# Altium schematic sheet 14_PoE_USB_PD.SchDoc: PoE and USB PD (part 2 of 3)
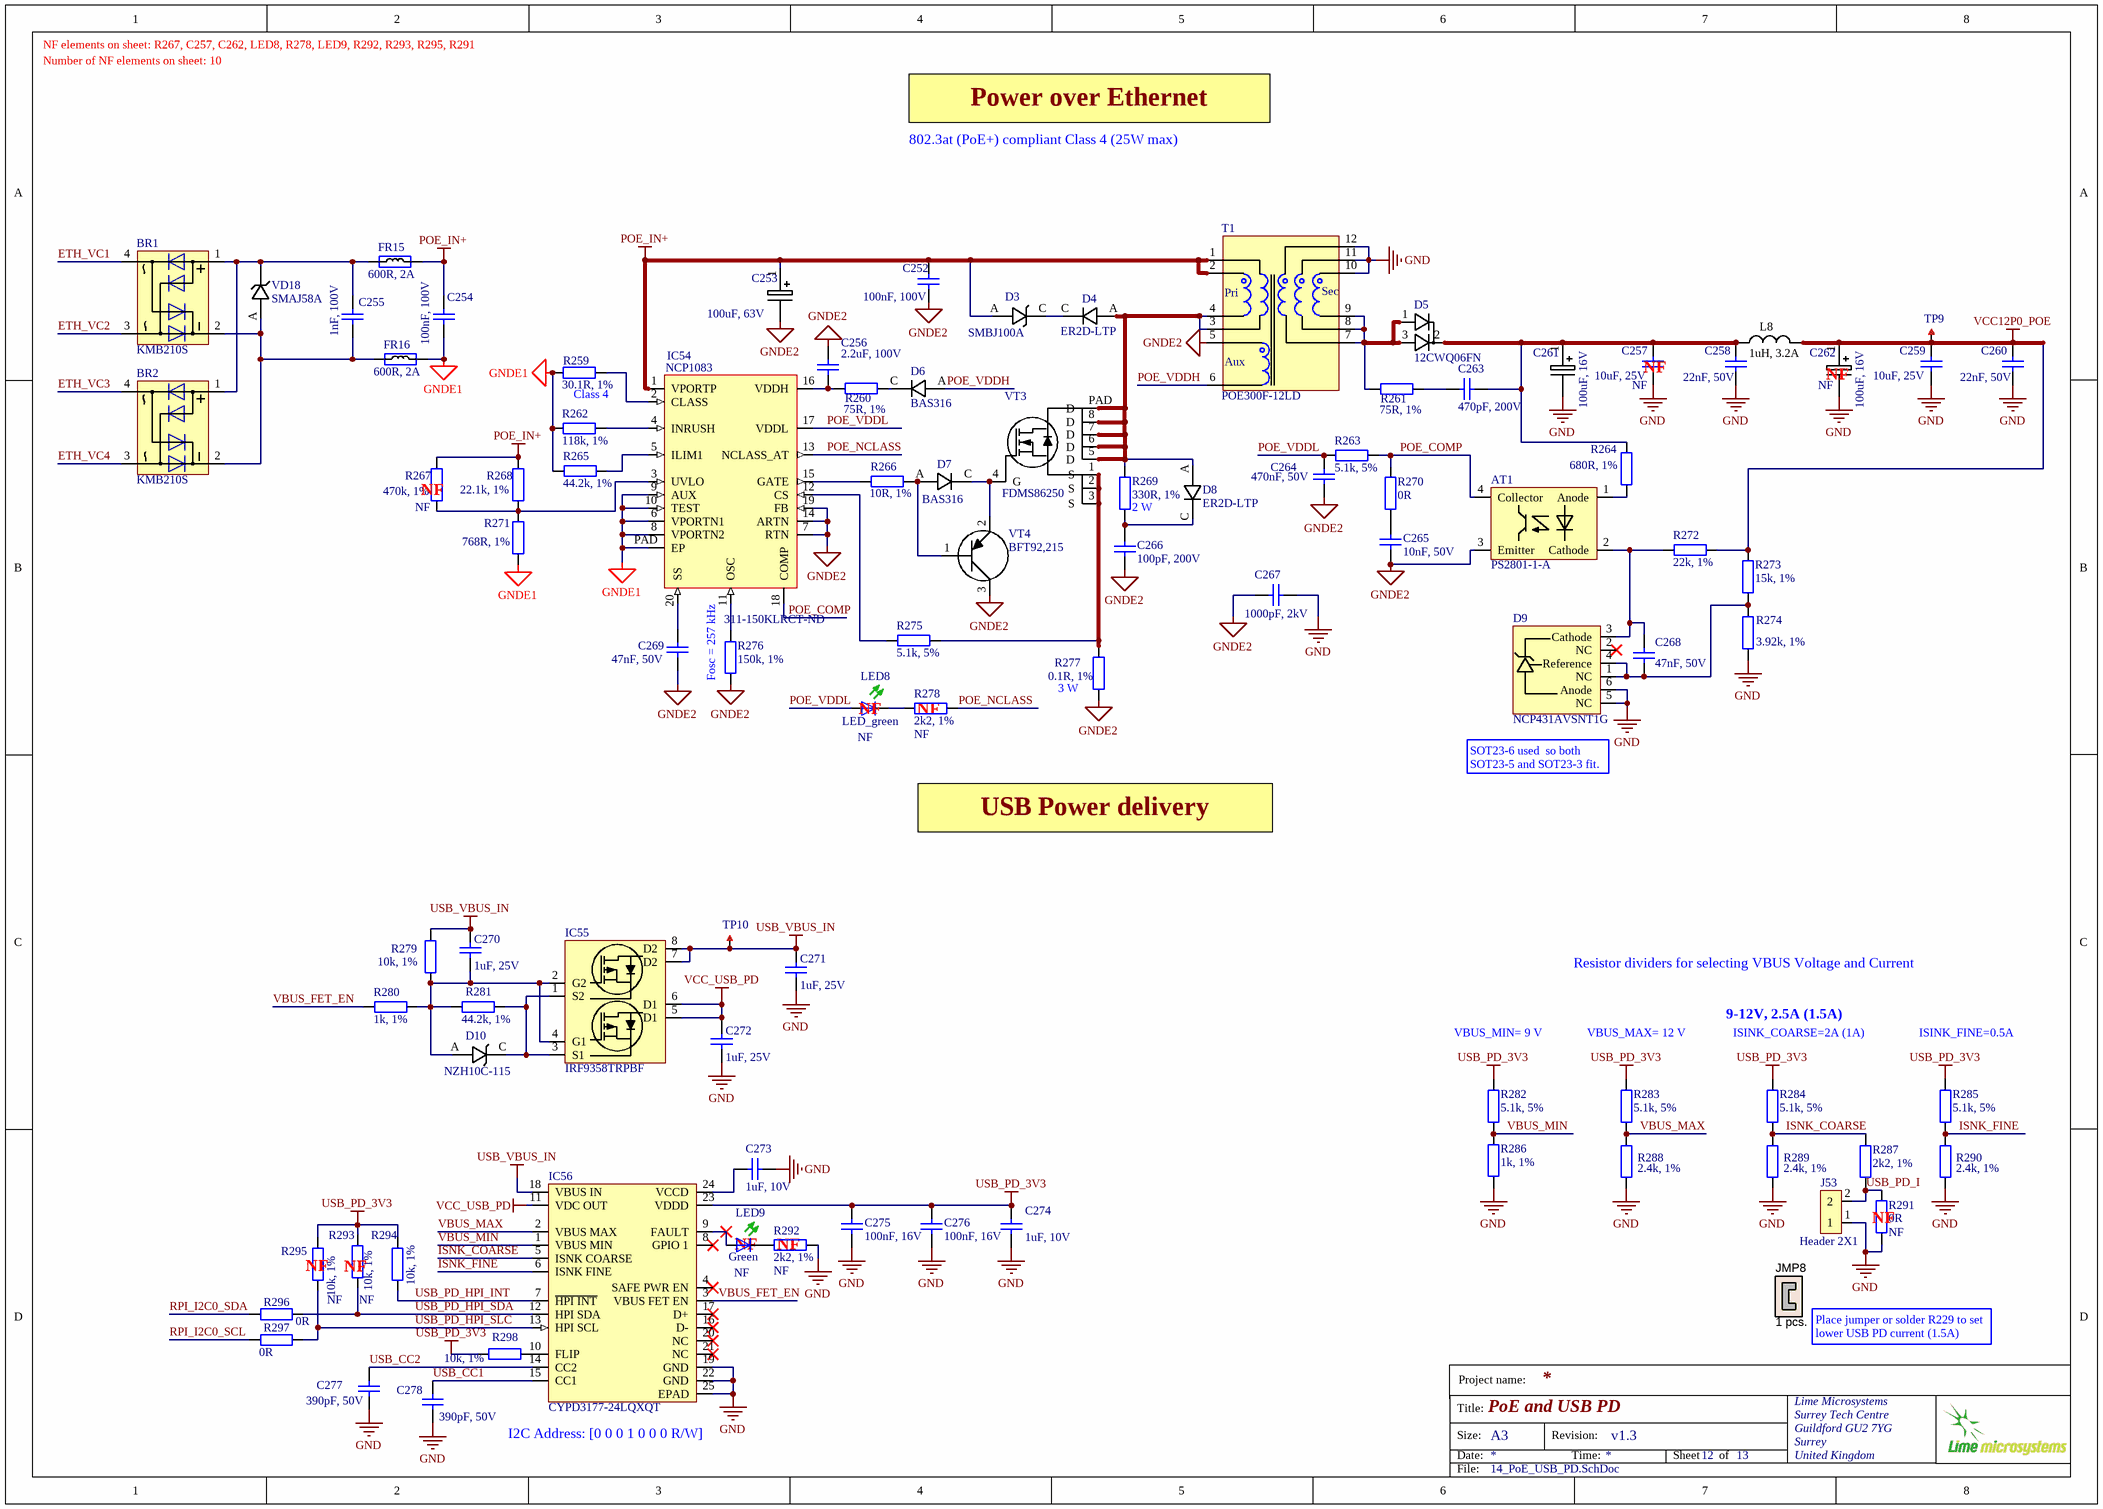
[diagram p1: 14_PoE_USB_PD.SchDoc]
## Library data of the parts
AT1 = TCMT1107CT_optoisolator: Part Description: Transistor Output Optocouplers OPTOCOUPLER 4-PIN SSOP; Manufacturer: Renesas; Isolation Voltage: 2.5kV; Number of Channels: 1; Output Voltage: 80V; Rise Time: 3us; ComponentLink1URL: https://www.verical.com/server-webapp/html/getDatasheet?partID=312696; ComponentLink1Description: https://www.verical.com/server-webapp/html/getDatasheet?partID=312696; ComponentLink2URL: https://www.fairchildsemi.com/datasheets/FO/FOD817A.pdf; ComponentLink2Description: https://www.fairchildsemi.com/datasheets/FO/FOD817A.pdf; ComponentLink3URL: http://www.fairchildsemi.com/ds/FO/FOD817A.pdf; ComponentLink3Description: http://www.fairchildsemi.com/ds/FO/FOD817A.pdf; ComponentLink4URL: http://www.fairchildsemi.com/datasheets/FO/FOD817A.pdf; ComponentLink4Description: http://www.fairchildsemi.com/datasheets/FO/FOD817A.pdf; ComponentLink5URL: http://www.mouser.com/ds/2/149/FOD817A-194238.pdf; ComponentLink5Description: http://www.mouser.com/ds/2/149/FOD817A-194238.pdf; ComponentLink6URL: https://www.fairchildsemi.com/datasheets/FO/FOD817D.pdf; ComponentLink6Description: https://www.fairchildsemi.com/datasheets/FO/FOD817D.pdf; ComponentLink7URL: http://www.jameco.com/Jameco/Products/ProdDS/1107109.pdf; ComponentLink7Description: http://www.jameco.com/Jameco/Products/ProdDS/1107109.pdf; ComponentLink8URL: http://www.vishay.com/docs/83510/tcmt1100.pdf; ComponentLink8Description: http://www.vishay.com/docs/83510/tcmt1100.pdf; ComponentLink9URL: http://www.mouser.com/ds/2/427/tcmt1100-103040.pdf; ComponentLink9Description: http://www.mouser.com/ds/2/427/tcmt1100-103040.pdf; ComponentLink10URL: http://www.farnell.com/datasheets/485045.pdf; ComponentLink10Description: http://www.farnell.com/datasheets/485045.pdf; Parameter 1: *; Supplier 1: Mouser; Supplier Part Number 1: 968-PS2801-1-A; Manufacturer Part Number 1: PS2801-1-A; Stock 1: 2813; Pricing 1: 1=1,17000, 10=0,74200, 50=0,74200, 100=0,54900, 1000=0,44800, 10000=0,43300 (USD); RoHS: Yes; Case/Package: SSOP; Number of Pins: 4; Packaging: Bulk; Package Quantity: 50; Number of Circuits: 1; Lead Free: Lead Free; RoHS Compliant: Yes
BR1 BR2 = KMB210S_RECTIFIER_BRIDGE: Part Description: Bridge Rectifier Single Phase Schottky 100 V Surface Mount MBS; Manufacturer: SMC Diode Solutions; Manufacturer Part Number 1: KMB210S; Supplier Part Number 1: 1655-KMB210SCT-ND; Supplier 1: Digi-Key
C252 C254 = Cap_0603: Manufacturer: Murata Electronics North America; Manufacturer Part Number 1: GRM188R72A104KA35D; Part Description: 0.1µF ±10% 100V Ceramic Capacitor X7R 0603 (1608 Metric); Temperature Coefficient: X7R; Tolerance: ±10%; Notification: Current market demand for these product types have resulted in fluctuating and extending lead times. Lead times may differ.; Value: 100nF, 100V; RoHS: RoHS Compliant; Packaging: Cut Tape (CT); Lead Spacing: -; Voltage - Rated: 100V; Package / Case: 0603 (1608 Metric); Category: Capacitors; Supplier 1: Digi-Key; Applications: General Purpose; Ratings: -; Part Status: Not For New Designs; Operating Temperature: -55°C ~ 125°C; Lead Style: -; Size / Dimension: 0.063" L x 0.031" W (1.60mm x 0.80mm); Supplier Part Number 1: 490-3285-1-ND; Height - Seated (Max): -; Features: -; Thickness (Max): 0.035" (0.90mm); Mounting Type: Surface Mount, MLCC
C253 = Cap_ceramic: Manufacturer: KEMET; Manufacturer Part Number 1: EEV107M063A9PAA; Part Description: 100 µF 63 V Aluminum Electrolytic Capacitors Radial, Can - SMD 2000 Hrs @ 105°C; Life (Hours): 2000Hour; Tolerance: 20%; ComponentLink1URL: http://components.arrow.com/part/dataview/41677645S8110057N1386; ComponentLink1Description: http://components.arrow.com/part/dataview/41677645S8110057N1386; ComponentLink2URL: https://www.distrelec.biz/Web/Downloads/_t/ds/PAN-FK_eng_tds.pdf?mime=application%2Fpdf; ComponentLink2Description: https://www.distrelec.biz/Web/Downloads/_t/ds/PAN-FK_eng_tds.pdf?mime=application%2Fpdf; ComponentLink3URL: http://uk.rs-online.com/webdocs/139e/0900766b8139e40f.pdf; ComponentLink3Description: http://uk.rs-online.com/webdocs/139e/0900766b8139e40f.pdf; ComponentLink4URL: http://www.alliedelec.com/m/d/e9dd47fa10a053d1f2828ce8bc944f54.pdf; ComponentLink4Description: http://www.alliedelec.com/m/d/e9dd47fa10a053d1f2828ce8bc944f54.pdf; ComponentLink5URL: https://industrial.panasonic.com/cdbs/www-data/pdf/RDE0000/ABA0000C1181.pdf; ComponentLink5Description: https://industrial.panasonic.com/cdbs/www-data/pdf/RDE0000/ABA0000C1181.pdf; ComponentLink6URL: http://www.farnell.com/datasheets/2002520.pdf; ComponentLink6Description: http://www.farnell.com/datasheets/2002520.pdf; ComponentLink7URL: http://industrial.panasonic.com/www-data/pdf/ABA0000/ABA0000CE120.pdf; ComponentLink7Description: http://industrial.panasonic.com/www-data/pdf/ABA0000/ABA0000CE120.pdf; ComponentLink8URL: http://www.farnell.com/datasheets/731857.pdf; ComponentLink8Description: http://www.farnell.com/datasheets/731857.pdf; ComponentLink9URL: http://www.produktinfo.conrad.com/datenblaetter/425000-449999/443507-da-01-en-SMD_ELKO_VFK_F_22_UF_100V.pdf; ComponentLink9Description: http://www.produktinfo.conrad.com/datenblaetter/425000-449999/443507-da-01-en-SMD_ELKO_VFK_F_22_UF_100V.pdf; ComponentLink10URL: https://industrial.panasonic.com/cdbs/www-data/pdf/RDE0000/DME0000COL90.pdf; ComponentLink10Description: https://industrial.panasonic.com/cdbs/www-data/pdf/RDE0000/DME0000COL90.pdf; ComponentLink11URL: http://www.industrial.panasonic.com/www-data/pdf/ABA0000/ABA0000CE2.pdf; ComponentLink11Description: http://www.industrial.panasonic.com/www-data/pdf/ABA0000/ABA0000CE2.pdf; ComponentLink12URL: http://www.mouser.com/ds/2/315/ABA0000C1145-947633.pdf; ComponentLink12Description: http://www.mouser.com/ds/2/315/ABA0000C1145-947633.pdf; ComponentLink13URL: http://www.farnell.com/datasheets/2648708.pdf; ComponentLink13Description: http://www.farnell.com/datasheets/2648708.pdf; ComponentLink14URL: http://industrial.panasonic.com/www-data/pdf/ABA0000/ABA0000CE2.pdf; ComponentLink14Description: http://industrial.panasonic.com/www-data/pdf/ABA0000/ABA0000CE2.pdf; ComponentLink15URL: https://datasheet.ciiva.com/15949/41cat-db-al-cgieejppdfnamemve-cgieejppdfnamemve-15949785.pdf?src-supplier=Onlinecomponents.com; ComponentLink15Description: https://datasheet.ciiva.com/15949/41cat-db-al-cgieejppdfnamemve-cgieejppdfnamemve-15949785.pdf?src-supplier=Onlinecomponents.com; Supplier 1: Digi-Key; Supplier Part Number 1: 399-6702-1-ND; Stock 1: 5871; Pricing 1: 1=0,92000, 10=0,69700, 50=0,57940, 100=0,49890 (USD); RoHS: Yes; Mount: Surface Mount; Case/Package: Radial; Min Operating Temperature: -40°C; Max Operating Temperature: 105°C; Termination: SMD/SMT; Package Quantity: 1; Capacitance: 100uF; Voltage Rating: 63V; Packaging: Tape and Reel; Voltage Rating (DC): 63V; Length: 10.2mm; Height - Seated (Max): 0.413inch; ComponentLink16URL: http://www.mouser.com/ds/2/212/KEM_A4002_EEV-535332.pdf?src-supplier=Mouser; ComponentLink16Description: http://www.mouser.com/ds/2/212/KEM_A4002_EEV-535332.pdf?src-supplier=Mouser; ComponentLink17URL: https://content.kemet.com/datasheets/KEM_A4002_EEV.pdf?src-supplier=Digi-Key; ComponentLink17Description: https://content.kemet.com/datasheets/KEM_A4002_EEV.pdf?src-supplier=Digi-Key
C255 = Cap_0603: Manufacturer: KEMET; Manufacturer Part Number 1: C0603C102K1RACTU; Part Description: 1000pF ±10% 100V Ceramic Capacitor X7R 0603 (1608 Metric); Tolerance: 10%; Dielectric: X7R; Dielectric Material: Ceramic; Value: 1nF, 100V; Radiation Hardening: No; Length: 1.6mm; Mount: Surface Mount; Case/Package: 0603; Width: 0.8mm; Height: 0.8mm; Dissipation Factor: 10%; Package Quantity: 1; Lead Pitch: 0.7mm; Voltage: 100V; Voltage Rating: 100V; Case Code (Metric): 1608; Termination: SMD/SMT; Thickness: 0.034inch; REACH SVHC: No SVHC; Supplier Part Number 1: 399-7831-2-ND; Min Operating Temperature: -55°C; Voltage Rating (DC): 100V; Case Code (Imperial): 0603; Number of Pins: 2; Packaging: Tape and Reel; Capacitance: 1nF; Max Operating Temperature: 125°C; Supplier 1: Digi-Key; Depth: 0.8mm
C256 = Cap_1206: Manufacturer: TDK Corporation; Part Description: 2.2µF ±10% 100V Ceramic Capacitor X7S 1206 (3216 Metric); Manufacturer Part Number 1: C3216X7S2A225K160AE; Temperature Coefficient: X7S; Tolerance: ±10%; Size / Dimension: 0.126" L x 0.063" W (3.20mm x 1.60mm); Packaging: Cut Tape (CT); Voltage - Rated: 100V; Category: Capacitors; Operating Temperature: -55°C ~ 125°C; Mounting Type: Surface Mount, MLCC; Lead Spacing: -; Ratings: -; Supplier Part Number 1: 445-8900-1-ND; Lead Style: -; Height - Seated (Max): -; Supplier 1: Digi-Key; Applications: Boardflex Sensitive; Features: Soft Termination; RoHS: RoHS Compliant; Part Status: Active; Thickness (Max): 0.075" (1.90mm); Failure Rate: -; Package / Case: 1206 (3216 Metric); Value: 2.2uF, 100V
C257 C259 = Cap_0603: Part Description: CAP CER 10UF 25V X5R 0805; Manufacturer: Murata; Manufacturer Part Number 1: GRM21BR61E106KA73K; Tolerance: 10%; Dielectric: X5R; value: 10uF, 25V; Supplier 1: Digi-Key; Supplier Part Number 1: 490-16824-1-ND; Stock 1: 781136; Pricing 1: 1=0,19, 10=0,13, 50=0,0778, 100=0,0656, 500=0,0449, 1000=0,03972, 2500=0,038, 5000=0,03454 (USD); RoHS: Yes; Mount: Surface Mount; Case/Package: 0805; Weight: 0.000335oz; Case Code (Imperial): 0805; Case Code (Metric): 2012; Min Operating Temperature: -55°C; Max Operating Temperature: 85°C; Packaging: Tape and Reel; Capacitance: 10uF; Voltage Rating: 25V; Package Quantity: 10000; Voltage Rating (DC): 25V; Series: GRM; Length: 0.079inch; Width: 0.049inch; Thickness: 0.055inch; RoHS Compliant: Yes; ComponentLink1URL: http://www.mouser.com/ds/2/281/c02e-2905.pdf?src-supplier=Mouser; ComponentLink1Description: http://www.mouser.com/ds/2/281/c02e-2905.pdf?src-supplier=Mouser; ComponentLink2URL: http://search.murata.co.jp/Ceramy/image/img/A01X/G101/ENG/GRM21BR61E106KA73-01.pdf?src-supplier=Digi-Key; ComponentLink2Description: http://search.murata.co.jp/Ceramy/image/img/A01X/G101/ENG/GRM21BR61E106KA73-01.pdf?src-supplier=Digi-Key; ComponentLink3URL: https://search.murata.co.jp/Ceramy/image/img/A01X/G101/ENG/GRM21BR61E106KA73-01.pdf?src-supplier=Digi-Key; ComponentLink3Description: https://search.murata.co.jp/Ceramy/image/img/A01X/G101/ENG/GRM21BR61E106KA73-01.pdf?src-supplier=Digi-Key
C258 C260 = Cap_0402: Manufacturer: Kemet; Manufacturer Part Number 1: C0402C223K5RACTU; Part Description: 0.022µF ±10% 50V X7R Ceramic Capacitor -55°C ~ 125°C Surface Mount, MLCC 0402 (1005 Metric) 0.039" L x 0.020" W (1.00mm x 0.50mm); Temperature Coefficient: X7R; Tolerance: ±10%; Capacitance: 0.022µF; Value: 22nF, 50V; Supplier 1: Digi-Key; Supplier Part Number 1: 399-7780-1-ND; Ratings: -; Packaging: Cut Tape (CT); Category: Capacitors; Size / Dimension: 0.039" L x 0.020" W (1.00mm x 0.50mm); RoHS: RoHS Compliant; Operating Temperature: -55°C ~ 125°C; Mounting Type: Surface Mount, MLCC; Applications: General Purpose; Voltage - Rated: 50V; Thickness (Max): 0.022" (0.55mm); Features: -; Height - Seated (Max): -; Lead Style: -; Package / Case: 0402 (1005 Metric); Lead Spacing: -
C261 C262 = Cap_ceramic: Manufacturer: Wurth Electronics; Manufacturer Part Number 1: 875105344010; Part Description: 100 µF 16 V Aluminum - Polymer Capacitors Radial, Can - SMD 20mOhm 2000 Hrs @ 105°C; ESR (Equivalent Series Resistance): 20mR; Polarity: Polar; Ripple Current: 2.69A; Life (Hours): 2000Hour; Tolerance: 20%; Value: 100uF, 16V; ComponentLink1URL: http://components.arrow.com/part/dataview/41677645S8110057N1386; ComponentLink1Description: http://components.arrow.com/part/dataview/41677645S8110057N1386; ComponentLink2URL: https://www.distrelec.biz/Web/Downloads/_t/ds/PAN-FK_eng_tds.pdf?mime=application%2Fpdf; ComponentLink2Description: https://www.distrelec.biz/Web/Downloads/_t/ds/PAN-FK_eng_tds.pdf?mime=application%2Fpdf; ComponentLink3URL: http://uk.rs-online.com/webdocs/139e/0900766b8139e40f.pdf; ComponentLink3Description: http://uk.rs-online.com/webdocs/139e/0900766b8139e40f.pdf; ComponentLink4URL: http://www.alliedelec.com/m/d/e9dd47fa10a053d1f2828ce8bc944f54.pdf; ComponentLink4Description: http://www.alliedelec.com/m/d/e9dd47fa10a053d1f2828ce8bc944f54.pdf; ComponentLink5URL: https://industrial.panasonic.com/cdbs/www-data/pdf/RDE0000/ABA0000C1181.pdf; ComponentLink5Description: https://industrial.panasonic.com/cdbs/www-data/pdf/RDE0000/ABA0000C1181.pdf; ComponentLink6URL: http://www.farnell.com/datasheets/2002520.pdf; ComponentLink6Description: http://www.farnell.com/datasheets/2002520.pdf; ComponentLink7URL: http://industrial.panasonic.com/www-data/pdf/ABA0000/ABA0000CE120.pdf; ComponentLink7Description: http://industrial.panasonic.com/www-data/pdf/ABA0000/ABA0000CE120.pdf; ComponentLink8URL: http://www.farnell.com/datasheets/731857.pdf; ComponentLink8Description: http://www.farnell.com/datasheets/731857.pdf; ComponentLink9URL: http://www.produktinfo.conrad.com/datenblaetter/425000-449999/443507-da-01-en-SMD_ELKO_VFK_F_22_UF_100V.pdf; ComponentLink9Description: http://www.produktinfo.conrad.com/datenblaetter/425000-449999/443507-da-01-en-SMD_ELKO_VFK_F_22_UF_100V.pdf; ComponentLink10URL: https://industrial.panasonic.com/cdbs/www-data/pdf/RDE0000/DME0000COL90.pdf; ComponentLink10Description: https://industrial.panasonic.com/cdbs/www-data/pdf/RDE0000/DME0000COL90.pdf; ComponentLink11URL: http://www.industrial.panasonic.com/www-data/pdf/ABA0000/ABA0000CE2.pdf; ComponentLink11Description: http://www.industrial.panasonic.com/www-data/pdf/ABA0000/ABA0000CE2.pdf; ComponentLink12URL: http://www.mouser.com/ds/2/315/ABA0000C1145-947633.pdf; ComponentLink12Description: http://www.mouser.com/ds/2/315/ABA0000C1145-947633.pdf; ComponentLink13URL: http://www.farnell.com/datasheets/2648708.pdf; ComponentLink13Description: http://www.farnell.com/datasheets/2648708.pdf; ComponentLink14URL: http://industrial.panasonic.com/www-data/pdf/ABA0000/ABA0000CE2.pdf; ComponentLink14Description: http://industrial.panasonic.com/www-data/pdf/ABA0000/ABA0000CE2.pdf; Supplier 1: Digi-Key; Supplier Part Number 1: 732-6425-1-ND; Stock 1: 19075; Pricing 1: 1=0,67000, 50=0,57400, 100=0,50000, 250=0,44500, 500=0,38900 (USD); RoHS: Yes; Mount: Surface Mount; Case/Package: Radial; Min Operating Temperature: -55°C; Max Operating Temperature: 105°C; Package Quantity: 1; Packaging: Cut Tape; Voltage Rating: 16V; Voltage Rating (DC): 16V; Capacitance: 100uF; Series: WCAP-PSLP; Height - Seated (Max): 0.228inch; RoHS Compliant: Yes; ComponentLink15URL: http://www.farnell.com/datasheets/1880501.pdf?src-supplier=Farnell; ComponentLink15Description: http://www.farnell.com/datasheets/1880501.pdf?src-supplier=Farnell; ComponentLink16URL: http://www.farnell.com/datasheets/1880501.pdf?src-supplier=Element14; ComponentLink16Description: http://www.farnell.com/datasheets/1880501.pdf?src-supplier=Element14; ComponentLink17URL: https://katalog.we-online.de/pbs/datasheet/875105344010.pdf?src-supplier=Digi-Key; ComponentLink17Description: https://katalog.we-online.de/pbs/datasheet/875105344010.pdf?src-supplier=Digi-Key; ComponentLink18URL: http://katalog.we-online.de/pbs/datasheet/875105344010.pdf?src-supplier=Digi-Key; ComponentLink18Description: http://katalog.we-online.de/pbs/datasheet/875105344010.pdf?src-supplier=Digi-Key
C263 = Cap_0402: Part Description: Multilayer Ceramic Capacitors MLCC - SMD/SMT 470pF, +-10%, 200V; Manufacturer: Walsin Technologies; Manufacturer Part Number 1: 0603B471K201CT; Supplier 1: Mouser; Supplier Part Number 1: 791-0603B471K201CT; Stock 1: 8000; Pricing 1: 1=0,11000, 10=0,05200, 50=0,05200, 100=0,02400, 1000=0,01300, 10000=0,00900 (USD); RoHS: Yes; RoHS Compliant: Yes
C264 = Cap_0402: Part Description: 0.47 µF ±10% 50V Ceramic Capacitor X5R 0603 (1608 Metric); Manufacturer: Taiyo Yuden; Manufacturer Part Number 1: UMK107ABJ474KA-T; Tolerance: 10%; Dielectric: X5R; ComponentLink1URL: http://www.mouser.com/ds/2/281/c02e-2905.pdf?src-supplier=Mouser; ComponentLink1Description: http://www.mouser.com/ds/2/281/c02e-2905.pdf?src-supplier=Mouser; ComponentLink2URL: http://search.murata.co.jp/Ceramy/image/img/A01X/partnumbering_e_01.pdf?src-supplier=Digi-Key; ComponentLink2Description: http://search.murata.co.jp/Ceramy/image/img/A01X/partnumbering_e_01.pdf?src-supplier=Digi-Key; Value: 470nF, 50V; ComponentLink3URL: http://search.murata.co.jp/Ceramy/image/img/A01X/G101/ENG/GRM155R61H474KE11-01.pdf?src-supplier=Digi-Key; ComponentLink3Description: http://search.murata.co.jp/Ceramy/image/img/A01X/G101/ENG/GRM155R61H474KE11-01.pdf?src-supplier=Digi-Key; ComponentLink4URL: https://search.murata.co.jp/Ceramy/image/img/A01X/G101/ENG/GRM155R61H474KE11-01.pdf?src-supplier=Digi-Key; ComponentLink4Description: https://search.murata.co.jp/Ceramy/image/img/A01X/G101/ENG/GRM155R61H474KE11-01.pdf?src-supplier=Digi-Key; Supplier 1: Digi-Key; Supplier Part Number 1: 587-3171-1-ND; Stock 1: 614194; Pricing 1: 1=0,15000, 10=0,10900, 50=0,06200, 100=0,05140, 500=0,03604, 1000=0,02984 (USD); RoHS: Yes; Mount: Surface Mount; Case/Package: 0603; Case Code (Imperial): 0603; Case Code (Metric): 1608; Min Operating Temperature: -55°C; Max Operating Temperature: 85°C; Capacitance: 470nF; Packaging: Tape and Reel; Package Quantity: 1; Voltage Rating: 50V; Voltage Rating (DC): 50V; Termination: SMD/SMT; Series: M; Construction: Flat; Voltage: 50V; Length: 1.6mm; Width: 0.8mm; Height: 0.8mm; Thickness: 0.037inch; Depth: 0.8mm; Radiation Hardening: No; RoHS Compliant: Yes; Lead Free: Lead Free; ComponentLink5URL: https://datasheet.ciiva.com/30226/445umk107abj474ka-t-30226784.pdf?src-supplier=Onlinecomponents.com; ComponentLink5Description: https://datasheet.ciiva.com/30226/445umk107abj474ka-t-30226784.pdf?src-supplier=Onlinecomponents.com; ComponentLink6URL: https://datasheet.ciiva.com/6282/umk107abj474ka-t-6282326.pdf?src-supplier=Digi-Key; ComponentLink6Description: https://datasheet.ciiva.com/6282/umk107abj474ka-t-6282326.pdf?src-supplier=Digi-Key; ComponentLink7URL: https://datasheet.ciiva.com/15922/30umk107abj474ka-t-15922603.pdf?src-supplier=Onlinecomponents.com; ComponentLink7Description: https://datasheet.ciiva.com/15922/30umk107abj474ka-t-15922603.pdf?src-supplier=Onlinecomponents.com; ComponentLink8URL: https://datasheet.ciiva.com/11600/umk107abj474ka-t-ss-11600413.pdf?src-supplier=Avnet; ComponentLink8Description: https://datasheet.ciiva.com/11600/umk107abj474ka-t-ss-11600413.pdf?src-supplier=Avnet; ComponentLink9URL: https://datasheet.ciiva.com/6282/umk107abj474ka-t-6282332.pdf?src-supplier=Digi-Key; ComponentLink9Description: https://datasheet.ciiva.com/6282/umk107abj474ka-t-6282332.pdf?src-supplier=Digi-Key
C265 = Cap_0402: Part Description: 10000pF ±10% 50V Ceramic Capacitor X7R 0402 (1005 Metric); Manufacturer: Murata Electronics North America; Manufacturer Part Number 1: GRM155R71H103KA88D; Tolerance: ±10%; Temperature Coefficient: X7R; value: 10nF, 50V; Supplier 1: Digi-Key; Supplier Part Number 1: 490-4516-2-ND; Stock 1: 10970000; Pricing 1: 10000=0.00185, 20000=0.00176, 30000=0.00167 (USD); RoHS: RoHS Compliant; Packaging: Tape & Reel (TR); ComponentLink1URL: http://www.murata.com/~/media/webrenewal/support/library/catalog/products/capacitor/mlcc/c02e.ashx?la=en-us; ComponentLink1Description: http://www.murata.com/~/media/webrenewal/support/library/catalog/products/capacitor/mlcc/c02e.ashx?la=en-us; Applications: General Purpose; Category: Capacitors; Features: -; Height - Seated (Max): -; Lead Spacing: -; Lead Style: -; Mounting Type: Surface Mount, MLCC; Operating Temperature: -55°C ~ 125°C; Package / Case: 0402 (1005 Metric); Part Status: Active; Ratings: -; Size / Dimension: 0.039" L x 0.020" W (1.00mm x 0.50mm); Thickness (Max): 0.022" (0.55mm); Voltage - Rated: 50V
C266 = Cap_0402: Part Description: CAP CER 100PF 200V C0G/NPO 0603; Manufacturer: Yageo; Manufacturer Part Number 1: CC0603JRNPOABN101; Dielectric Material: Ceramic; Tolerance: 5%; Dielectric: C0G; Applications: General Purpose; Supplier 1: Digi-Key; Supplier Part Number 1: 311-3979-1-ND; Stock 1: 39006; Pricing 1: 1=0,11000, 10=0,08400, 50=0,04560, 100=0,03720, 500=0,02660, 1000=0,02090 (USD); RoHS: Yes; Mount: Surface Mount; Case/Package: 0603; Case Code (Metric): 1608; Case Code (Imperial): 0603; Weight: 7.1E-05oz; Min Operating Temperature: -55°C; Max Operating Temperature: 125°C; Capacitance: 100pF; Packaging: Tape and Reel; Voltage Rating: 200V; Voltage Rating (DC): 200V; Termination: SMD/SMT; Resistor Type: Ceramic; Series: CC; Construction: Flat; Length: 1.6mm; Width: 0.031inch; Height: 0.8mm; Thickness: 0.035inch; Depth: 0.8mm; Radiation Hardening: No; REACH SVHC: Unknown; RoHS Compliant: Yes; ComponentLink1URL: https://datasheet.ciiva.com/8033/1669968-8033768.pdf?src-supplier=Element14; ComponentLink1Description: https://datasheet.ciiva.com/8033/1669968-8033768.pdf?src-supplier=Element14; ComponentLink2URL: https://datasheet.ciiva.com/8033/1669968-8033767.pdf?src-supplier=Element14; ComponentLink2Description: https://datasheet.ciiva.com/8033/1669968-8033767.pdf?src-supplier=Element14; ComponentLink3URL: https://datasheet.ciiva.com/13263/upy-gp-np0-16v-to-50v-8-3714-13263783.pdf?src-supplier=Mouser; ComponentLink3Description: https://datasheet.ciiva.com/13263/upy-gp-np0-16v-to-50v-8-3714-13263783.pdf?src-supplier=Mouser; ComponentLink4URL: https://datasheet.ciiva.com/11465/upy-np0x7r-mv-100-to-630v-9-11465021.pdf?src-supplier=Avnet; ComponentLink4Description: https://datasheet.ciiva.com/11465/upy-np0x7r-mv-100-to-630v-9-11465021.pdf?src-supplier=Avnet
C267 = Cap_1206: Manufacturer Part Number 1: C1812C102KGRACTU; Manufacturer: KEMET; Part Description: 1000pF ±10% 2000V (2kV) Ceramic Capacitor X7R 1812 (4532 Metric); Manufacturer Part Number: C1812C102KGRACAUTO; Tolerance: ±10%; Notification: Current market demand for these product types have resulted in fluctuating and extending lead times. Lead times may differ.; Voltage - Rated: 2000V (2kV); Temperature Coefficient: X7R; Dielectric Material: Ceramic; Capacitance: 1nF; Packaging: Cut Tape (CT); Supplier Part Number 1: 399-3447-1-ND; Supplier 1: Digi-Key; Part Status: Active; Category: Capacitors; RoHS: RoHS Compliant; Mounting Type: Surface Mount, MLCC; Applications: General Purpose; Lead Style: -; Ratings: -; Height - Seated (Max): -; Thickness (Max): 0.061" (1.55mm); Size / Dimension: 0.177" L x 0.126" W (4.50mm x 3.20mm); Package / Case: 1812 (4532 Metric); Failure Rate: -; Lead Spacing: -; Features: High Voltage; Operating Temperature: -55°C ~ 125°C; Value: 1000pF, 2kV; Supplier 2: Digi-Key; Supplier Part Number 2: 399-16774-1-ND; Stock 2: 4004; Pricing 2: 1=0.51, 10=0.355, 100=0.2132, 500=0.1599 (USD); Case/Package: 1812; Weight: 0.000952oz; Case Code (Imperial): 1812; Case Code (Metric): 4532; Min Operating Temperature: -55°C; Max Operating Temperature: 125°C; Voltage Rating (DC): 2kV; Dielectric: X7R; Termination: SMD/SMT; Length: 4.5mm; Width: 3.2mm
C268 C269 = Cap_0603: Manufacturer: Yageo; Manufacturer Part Number 1: CC0603KRX7R9BB473; Part Description: 0.047µF ±10% 50V Ceramic Capacitor X7R 0603 (1608 Metric); Tolerance: 10%; Dielectric: X7R; Value: 47nF, 50V; Supplier 1: Digi-Key; Supplier Part Number 1: 311-1427-1-ND; Stock 1: 1174358; Pricing 1: 1=0.11, 10=0.08, 100=0.0358, 500=0.02558, 1000=0.0201 (USD); Mount: Surface Mount; Case/Package: 0603; Case Code (Metric): 1608; Case Code (Imperial): 0603; Min Operating Temperature: -55°C; Max Operating Temperature: 125°C; Package Quantity: 1; Capacitance: 47nF; Voltage Rating: 50V; Packaging: Tape and Reel; Voltage Rating (DC): 50V; Termination: SMD/SMT; Composition: Ceramic; Voltage: 50V; Length: 1.6mm; Height: 0.8mm; Width: 0.031inch; Thickness: 0.035inch; Depth: 0.8mm; Radiation Hardening: No; REACH SVHC: Unknown; Lead Free: Lead Free; Halogen Free: Halogen Free; ComponentLink1URL: http://www.yageo.com/documents/recent/UPY-GPHC_X7R_6.3V-to-50V_18.pdf; ComponentLink1Description: http://www.yageo.com/documents/recent/UPY-GPHC_X7R_6.3V-to-50V_18.pdf; ComponentLink2URL: http://www.yageo.com/exep/pages/download/literatures/ProductSelectionGuide%202014_Final_2.pdf; ComponentLink2Description: http://www.yageo.com/exep/pages/download/literatures/ProductSelectionGuide%202014_Final_2.pdf; ComponentLink3URL: http://documents.rs-components.com/techlib://itc_doclist_GB.htm?stockno=6698811; ComponentLink3Description: http://documents.rs-components.com/techlib://itc_doclist_GB.htm?stockno=6698811; ComponentLink4URL: http://www.farnell.com/datasheets/1489800.pdf; ComponentLink4Description: http://www.farnell.com/datasheets/1489800.pdf; ComponentLink5URL: https://www.verical.com/server-webapp/html/getDatasheet?partID=403593; ComponentLink5Description: https://www.verical.com/server-webapp/html/getDatasheet?partID=403593
C270-C272 = Cap_0603: Manufacturer: Samsung Electro-Mechanics; Manufacturer Part Number 1: CL10A105KA8NNNC; Part Description: 1µF ±10% 25V Ceramic Capacitor X5R 0603 (1608 Metric); Notification: Current market demand for these product types have resulted in fluctuating and extending lead times. Lead times may differ.; Temperature Coefficient: X5R; Tolerance: ±10%; Lead Spacing: -; Lead Style: -; Thickness (Max): 0.035" (0.90mm); Features: -; Operating Temperature: -55°C ~ 85°C; Size / Dimension: 0.063" L x 0.031" W (1.60mm x 0.80mm); Height - Seated (Max): -; Applications: General Purpose; Mounting Type: Surface Mount, MLCC; Package / Case: 0603 (1608 Metric); Ratings: -; Supplier Part Number 1: 1276-1102-1-ND; Packaging: Cut Tape (CT); Voltage - Rated: 25V; RoHS: RoHS Compliant; Supplier 1: Digi-Key; Category: Capacitors; Part Status: Active; Value: 1uF, 25V
C273 C274 = Cap_0402: CAP CER 1UF 10V X5R 0402; Manufacturer: Yageo; Part Description: 1µF 10V Ceramic Capacitor X5R 0402 (1005 Metric) 0.039" L x 0.020" W (1.00mm x 0.50mm); Manufacturer Part Number 1: CC0402MRX5R6BB105; Notification: Current market demand for these product types have resulted in fluctuating and extending lead times. Lead times may differ.; Tolerance: ±20%; Value: 1uF, 10V; Supplier 1: Digi-Key; Supplier Part Number 1: 311-1732-1-ND; RoHS: RoHS Compliant; Applications: General Purpose; Category: Capacitors; ComponentLink1Description: http://www.yageo.com/documents/recent/UPY-GPHC_X5R_4V-to-50V_25.pdf; ComponentLink1URL: http://www.yageo.com/documents/recent/UPY-GPHC_X5R_4V-to-50V_25.pdf; Failure Rate: -; Features: -; Height - Seated (Max): -; Lead Spacing: -; Lead Style: -; Mounting Type: Surface Mount, MLCC; Operating Temperature: -55°C ~ 85°C; Package / Case: 0402 (1005 Metric); Packaging: Cut Tape (CT); Part Status: Active; Pricing 1: 1=0.22, 10=0.156, 100=0.0732, 500=0.0513, 1000=0.04248, 2500=0.03953, 5000=0.03617 (USD); Ratings: -; Size / Dimension: 0.039" L x 0.020" W (1.00mm x 0.50mm); Stock 1: 69600; Temperature Coefficient: X5R; Thickness (Max): 0.022" (0.55mm); Voltage - Rated: 10V
C275 C276 = Cap_0603: Manufacturer Part Number 1: GRM155R71C104KA88D; Part Description: 0.10µF ±10% 16V Ceramic Capacitor X7R 0402 (1005 Metric); Brand: Murata Electronics; Tolerance: 10 %; Type: General Purpose MLCC; Capacitance: 0.1 uF; Temperature Coefficient / Code: +/- 15 %; Supplier 1: Mouser; Supplier Part Number 1: 81-GRM155R71C104KA88; Case Code - in: 0402; Manufacturer: Murata Electronics; Category: Multilayer Ceramic Capacitors MLCC - SMD/SMT; Voltage Rating DC: 16 V; Value: 100nF, 16V; Maximum Operating Temperature: + 125 C; Minimum Operating Temperature: - 55 C; Minimum Order Quantity: 1; Operating Temperature Range: - 55 C to + 125 C; Package / Case: 0402 (1005 metric); Packaging: Reel; Product: General Type MLCCs; Product Category: Low & Medium Capacitance SMD Ceramic Chip Capacitors; Reeling: True; RoHS - Mouser: Y; RoHS: RoHS Compliant; Series: GRM; Standard Pack Qty: 10000; Termination Style: SMD/SMT; Manufacturer Part Number: GRM155R71C104KA88D
C277 C278 = Cap_0402: Manufacturer: Samsung; Manufacturer Part Number 1: CL05B391KB5NNNC; Part Description: 390 pF ±10% 50V Ceramic Capacitor X7R 0402 (1005 Metric); Tolerance: 10%; Dielectric: X7R; Value: 390pF, 50V; Supplier 1: Digi-Key; Supplier Part Number 1: 1276-1560-1-ND; Stock 1: 1313447; Pricing 1: 1=0,10000, 10=0,03400, 50=0,01860, 100=0,01520, 500=0,01088, 1000=0,00855, 2500=0,00778, 5000=0,00715 (USD); RoHS: Yes; Mount: Surface Mount; Case/Package: 0402; Case Code (Metric): 1005; Case Code (Imperial): 0402; Min Operating Temperature: -55°C; Max Operating Temperature: 125°C; Packaging: Tape and Reel; Capacitance: 390pF; Package Quantity: 1; Voltage Rating: 50V; Voltage: 50V; Series: CL; Construction: Flat; Length: 1mm; Width: 0.02inch; Height: 0.5mm; Thickness: 0.022inch; Depth: 0.5mm; Radiation Hardening: No; RoHS Compliant: Yes; ComponentLink1URL: https://datasheet.ciiva.com/25738/cl05b391kb5nnnc-25738709.pdf?src-supplier=Digi-Key; ComponentLink1Description: https://datasheet.ciiva.com/25738/cl05b391kb5nnnc-25738709.pdf?src-supplier=Digi-Key; ComponentLink2URL: https://datasheet.ciiva.com/26838/getdatasheetpartid-660062-26838242.pdf?src-supplier=Verical; ComponentLink2Description: https://datasheet.ciiva.com/26838/getdatasheetpartid-660062-26838242.pdf?src-supplier=Verical; ComponentLink3URL: https://datasheet.ciiva.com/16202/cl05b104kq5nnnc-16202591.pdf?src-supplier=Future+Electronics; ComponentLink3Description: https://datasheet.ciiva.com/16202/cl05b104kq5nnnc-16202591.pdf?src-supplier=Future+Electronics
D3 = MMSZ5245B_shottky_diode: Part Description: ESD Suppressors / TVS Diodes 600W 100V 5% Uni-Directional; Manufacturer: Littelfuse; Clamping Voltage: 162V; Peak Pulse Power: 600W; Reverse Standoff Voltage: 100V; Peak Pulse Current: 3.7A; Test Current: 1mA; Min Breakdown Voltage: 111V; Polarity: Unidirectional; Number of Unidirectional Channels: 1; Power Line Protection: No; Leakage Current: 1uA; Diode Type: ZENER; ComponentLink1URL: http://www.mouser.com/ds/2/427/mmsz5225-102133.pdf; ComponentLink1Description: http://www.mouser.com/ds/2/427/mmsz5225-102133.pdf; Supplier 1: Digi-Key; Supplier Part Number 1: SMBJ100ALFCT-ND; Manufacturer Part Number 1: SMBJ100A; Stock 1: 13675; Pricing 1: 1=0,36000, 10=0,29300, 100=0,19970, 500=0,14980, 1000=0,11236 (USD); RoHS: Yes; Mount: Surface Mount; Case/Package: DO-214AA; Number of Pins: 2; Min Operating Temperature: -65°C; Max Operating Temperature: 150°C; Packaging: Tape and Reel; Package Quantity: 3000; Max Surge Current: 3.7A; Breakdown Voltage: 111V; Reverse Breakdown Voltage: 111V; Number of Elements: 1; Operating Supply Voltage: 100V; Number of Channels: 1; Resistor Type: Zener; Series: SMBJ; Termination: SMD/SMT; Voltage Rating (DC): 100V; Length: 5.59mm; Width: 3.94mm; Height: 2.44mm; RoHS Compliant: Yes; Lead Free: Lead Free; ComponentLink2URL: https://datasheet.ciiva.com/331/littelfuse-tvs-diode-smbj-datasheet-pdf-331299.pdf?src-supplier=Digi-Key; ComponentLink2Description: https://datasheet.ciiva.com/331/littelfuse-tvs-diode-smbj-datasheet-pdf-331299.pdf?src-supplier=Digi-Key; ComponentLink3URL: https://datasheet.ciiva.com/331/littelfuse-tvs-diode-smbj-datasheet-pdf-331300.pdf?src-supplier=Digi-Key; ComponentLink3Description: https://datasheet.ciiva.com/331/littelfuse-tvs-diode-smbj-datasheet-pdf-331300.pdf?src-supplier=Digi-Key; ComponentLink4URL: https://datasheet.ciiva.com/331/littelfuse-tvs-diode-smbj-datasheet-pdf-331301.pdf?src-supplier=Digi-Key; ComponentLink4Description: https://datasheet.ciiva.com/331/littelfuse-tvs-diode-smbj-datasheet-pdf-331301.pdf?src-supplier=Digi-Key
D4 D8 = MURA120T3G_diode: Part Description: DIODE GEN PURP 200V 2A DO214AA; Manufacturer: MCC; Average Rectified Current: 2A; Reverse Recovery Time: 35ns; Element Configuration: Single; Max Reverse Voltage (DC): 200V; ComponentLink1URL: http://www.mouser.com/ds/2/427/mmsz5225-102133.pdf; ComponentLink1Description: http://www.mouser.com/ds/2/427/mmsz5225-102133.pdf; ComponentLink2URL: http://www.onsemi.com/pub/Collateral/MMSD4148T1-D.PDF; ComponentLink2Description: http://www.onsemi.com/pub/Collateral/MMSD4148T1-D.PDF; ComponentLink3URL: http://www.farnell.com/datasheets/1707241.pdf; ComponentLink3Description: http://www.farnell.com/datasheets/1707241.pdf; ComponentLink4URL: https://www.verical.com/server-webapp/html/getDatasheet?partID=78734; ComponentLink4Description: https://www.verical.com/server-webapp/html/getDatasheet?partID=78734; ComponentLink5URL: http://www.onsemi.com/pub/Collateral/MURA115T3-D.PDF; ComponentLink5Description: http://www.onsemi.com/pub/Collateral/MURA115T3-D.PDF; ComponentLink6URL: http://www.jameco.com/Jameco/Products/ProdDS/1100812.pdf; ComponentLink6Description: http://www.jameco.com/Jameco/Products/ProdDS/1100812.pdf; ComponentLink7URL: http://uk.rs-online.com/webdocs/1221/0900766b812212fb.pdf; ComponentLink7Description: http://uk.rs-online.com/webdocs/1221/0900766b812212fb.pdf; ComponentLink8URL: http://www.farnell.com/datasheets/1750742.pdf; ComponentLink8Description: http://www.farnell.com/datasheets/1750742.pdf; Supplier 1: Digi-Key; Supplier Part Number 1: 353-ER2D-LTPCT-ND; Manufacturer Part Number 1: ER2D-LTP; Stock 1: 4206; Pricing 1: 1=0,45000, 10=0,33600, 100=0,20900, 500=0,14300, 1000=0,11000 (USD); RoHS: Yes; Mount: Surface Mount; Package Quantity: 3000; Packaging: Tape and Reel; Series: -; Lead Free: Lead Free; RoHS Compliant: Yes; ComponentLink9URL: https://datasheet.ciiva.com/6369/er2a-ler2j-ldo-214aa-6369821.pdf?src-supplier=Digi-Key; ComponentLink9Description: https://datasheet.ciiva.com/6369/er2a-ler2j-ldo-214aa-6369821.pdf?src-supplier=Digi-Key
D5 = 12CWQ06FN_diode_array: Part Description: Diode Array 1 Pair Common Cathode Schottky 60 V Surface Mount TO-252-3, DPak (2 Leads + Tab), SC-63; Manufacturer: Sangdest Microelectronics; Supplier 1: Digi-Key; Supplier Part Number 1: 1655-12CWQ06FNCT-ND; Manufacturer Part Number 1: 12CWQ06FN; Stock 1: 56408; Pricing 1: 1=0,70000, 10=0,61700, 100=0,47270, 500=0,37364, 1000=0,29892 (USD); RoHS: No
D6 D7 = MURA120T3G_diode: Part Description: DIODE GEN PURP 100V 250MA SOD323; Manufacturer: Nexperia; Manufacturer Part Number 1: BAS316,115; ComponentLink1URL: http://www.mouser.com/ds/2/427/mmsz5225-102133.pdf; ComponentLink1Description: http://www.mouser.com/ds/2/427/mmsz5225-102133.pdf; ComponentLink2URL: http://www.onsemi.com/pub/Collateral/MMSD4148T1-D.PDF; ComponentLink2Description: http://www.onsemi.com/pub/Collateral/MMSD4148T1-D.PDF; ComponentLink3URL: http://www.farnell.com/datasheets/1707241.pdf; ComponentLink3Description: http://www.farnell.com/datasheets/1707241.pdf; ComponentLink4URL: https://www.verical.com/server-webapp/html/getDatasheet?partID=78734; ComponentLink4Description: https://www.verical.com/server-webapp/html/getDatasheet?partID=78734; ComponentLink5URL: http://www.onsemi.com/pub/Collateral/MURA115T3-D.PDF; ComponentLink5Description: http://www.onsemi.com/pub/Collateral/MURA115T3-D.PDF; ComponentLink6URL: http://www.jameco.com/Jameco/Products/ProdDS/1100812.pdf; ComponentLink6Description: http://www.jameco.com/Jameco/Products/ProdDS/1100812.pdf; ComponentLink7URL: http://uk.rs-online.com/webdocs/1221/0900766b812212fb.pdf; ComponentLink7Description: http://uk.rs-online.com/webdocs/1221/0900766b812212fb.pdf; ComponentLink8URL: http://www.farnell.com/datasheets/1750742.pdf; ComponentLink8Description: http://www.farnell.com/datasheets/1750742.pdf; Supplier 1: Digi-Key; Supplier Part Number 1: 1727-4309-1-ND; Stock 1: 163548; Pricing 1: 1=0,16000, 10=0,14200, 100=0,07710, 500=0,04744, 1000=0,03234 (USD); RoHS: Yes; RoHS Compliant: Yes; ComponentLink9URL: http://www.farnell.com/datasheets/1856332.pdf?src-supplier=Farnell; ComponentLink9Description: http://www.farnell.com/datasheets/1856332.pdf?src-supplier=Farnell; ComponentLink10URL: https://assets.nexperia.com/documents/data-sheet/BAS16_SER.pdf?src-supplier=Digi-Key; ComponentLink10Description: https://assets.nexperia.com/documents/data-sheet/BAS16_SER.pdf?src-supplier=Digi-Key; ComponentLink11URL: http://www.farnell.com/datasheets/1856332.pdf?src-supplier=Newark; ComponentLink11Description: http://www.farnell.com/datasheets/1856332.pdf?src-supplier=Newark
D9 = NCP431AVSNT1GOSCT_VREF: Part Description: Shunt Voltage Reference IC Adjustable 2.5V 36 VV ±1% 100 mA SOT-23-3 (TO-236); Manufacturer: ON Semiconductor; Max Input Voltage: 2.525V; Max Output Current: 100mA; Output Voltage: 36V; Min Input Voltage: 2.475V; Tolerance: 1%; Min Output Voltage: 2.5V; Temperature Coefficient: 50ppm/°C; Cathode Current: 60uA; Reference Type: Shunt,Adjustable,Programmable; Output Type: Adjustable; Supplier 1: Digi-Key; Supplier Part Number 1: NCP431AVSNT1GOSCT-ND; Manufacturer Part Number 1: NCP431AVSNT1G; Stock 1: 4600; Pricing 1: 1=0,44000, 10=0,35700, 25=0,32640, 100=0,24290, 250=0,22008, 500=0,18216, 1000=0,13661 (USD); RoHS: Yes; Case/Package: SOT-23-3; Number of Pins: 3; Min Operating Temperature: -40°C; Max Operating Temperature: 125°C; Package Quantity: 3000; Packaging: Tape and Reel; Max Output Voltage: 36V; Output Current: 100mA; Reference Voltage: 2.5V; Length: 3.04mm; Width: 1.4mm; Height: 1.01mm; Radiation Hardening: No; REACH SVHC: No SVHC; Lead Free: Lead Free; Halogen Free: Halogen Free; ComponentLink1URL: https://datasheet.ciiva.com/8132/ncp431-d-8132432.pdf?src-supplier=Avnet; ComponentLink1Description: https://datasheet.ciiva.com/8132/ncp431-d-8132432.pdf?src-supplier=Avnet; ComponentLink2URL: https://datasheet.ciiva.com/30476/0900766b8121bbe3-30476322.pdf?src-supplier=RSComponents; ComponentLink2Description: https://datasheet.ciiva.com/30476/0900766b8121bbe3-30476322.pdf?src-supplier=RSComponents; ComponentLink3URL: https://datasheet.ciiva.com/49020/70300496-49020892.pdf?src-supplier=Allied+Electronics; ComponentLink3Description: https://datasheet.ciiva.com/49020/70300496-49020892.pdf?src-supplier=Allied+Electronics
D10 = MMSZ5245B_shottky_diode: Part Description: DIODE ZENER 10V 500MW SOD123F; Manufacturer: Nexperia; Manufacturer Part Number 1: NZH10C,115; ComponentLink1URL: http://www.mouser.com/ds/2/427/mmsz5225-102133.pdf; ComponentLink1Description: http://www.mouser.com/ds/2/427/mmsz5225-102133.pdf; ComponentLink2URL: https://datasheet.ciiva.com/331/littelfuse-tvs-diode-smbj-datasheet-pdf-331299.pdf?src-supplier=Digi-Key; ComponentLink2Description: https://datasheet.ciiva.com/331/littelfuse-tvs-diode-smbj-datasheet-pdf-331299.pdf?src-supplier=Digi-Key; ComponentLink3URL: https://datasheet.ciiva.com/331/littelfuse-tvs-diode-smbj-datasheet-pdf-331300.pdf?src-supplier=Digi-Key; ComponentLink3Description: https://datasheet.ciiva.com/331/littelfuse-tvs-diode-smbj-datasheet-pdf-331300.pdf?src-supplier=Digi-Key; ComponentLink4URL: https://datasheet.ciiva.com/331/littelfuse-tvs-diode-smbj-datasheet-pdf-331301.pdf?src-supplier=Digi-Key; ComponentLink4Description: https://datasheet.ciiva.com/331/littelfuse-tvs-diode-smbj-datasheet-pdf-331301.pdf?src-supplier=Digi-Key; Supplier 1: Digi-Key; Supplier Part Number 1: 1727-5057-1-ND; Stock 1: 6768; Pricing 1: 1=0,27000, 10=0,22200, 100=0,11780, 500=0,07752, 1000=0,05271 (USD); RoHS: Yes; RoHS Compliant: Yes; ComponentLink5URL: http://www.farnell.com/datasheets/1508365.pdf?src-supplier=Farnell; ComponentLink5Description: http://www.farnell.com/datasheets/1508365.pdf?src-supplier=Farnell
FR15 FR16 = Ferrite: Manufacturer Part Number 1: MPZ2012S601AT000; Manufacturer: TDK Corporation; Part Description: FERRITE BEAD 600 OHM 0805 1LN; Filter Type: Differential Mode - Single; Impedance @ Frequency: 600 Ohm @ 100MHz; DC Resistance (DCR): 100 mOhm Max; Supplier 1: Digi-Key; Supplier Part Number 1: 445-2206-2-ND; Mounting Type: Surface Mount; RoHS: RoHS Compliant; Height (Max): 0.041" (1.05mm); Packaging: Tape & Reel (TR); Category: Filters; Current Rating: 2A; Package / Case: 0805 (2012 Metric); Size / Dimension: 0.079" L x 0.049" W (2.00mm x 1.25mm); Value: 600R, 2A
IC54 = NCP1083_PoE_controller: Part Description: Power Over Ethernet Controller 1 Channel 802.3at (PoE+), 802.3af (PoE) 20-TSSOP-EP; Manufacturer: ON Semiconductor; Manufacturer Part Number: NCP1083DER2G; Nominal Supply Current: 1.1A; Frequency: 500kHz; Output Voltage: 9V; Number of Outputs: 1; Max Duty Cycle: 80%; Max Power Dissipation: 40W; Topology: Flyback; Supplier 1: Digi-Key; Supplier Part Number 1: NCP1083DER2GOSCT-ND; Stock 1: 12659; Pricing 1: 1=4,10000, 10=3,68200, 25=3,48120, 100=3,01700, 250=2,86228, 500=2,56832, 1000=2,16605 (USD); RoHS: Yes; Case/Package: TSSOP; Number of Pins: 20; Min Operating Temperature: -40°C; Max Operating Temperature: 85°C; Switching Frequency: 500kHz; Output Current: 1.1A; Package Quantity: 2500; Packaging: Tape and Reel; Number of Channels: 1; Series: -; Supply Current: 1.1A; Radiation Hardening: No; REACH SVHC: No SVHC; Lead Free: Lead Free; Halogen Free: Halogen Free; RoHS Compliant: Yes; ComponentLink1URL: https://datasheet.ciiva.com/9213/ncp1083-d-9213696.pdf?src-supplier=Avnet; ComponentLink1Description: https://datasheet.ciiva.com/9213/ncp1083-d-9213696.pdf?src-supplier=Avnet; ComponentLink2URL: https://datasheet.ciiva.com/1573/1441870-1573173.pdf?src-supplier=Farnell; ComponentLink2Description: https://datasheet.ciiva.com/1573/1441870-1573173.pdf?src-supplier=Farnell; ComponentLink3URL: https://datasheet.ciiva.com/1647/1441870-1647157.pdf?src-supplier=Newark; ComponentLink3Description: https://datasheet.ciiva.com/1647/1441870-1647157.pdf?src-supplier=Newark; ComponentLink4URL: https://datasheet.ciiva.com/1573/1441870-1573174.pdf?src-supplier=Farnell; ComponentLink4Description: https://datasheet.ciiva.com/1573/1441870-1573174.pdf?src-supplier=Farnell; ComponentLink5URL: https://datasheet.ciiva.com/16469/ncp1083-d-16469798.pdf?src-supplier=Future+Electronics; ComponentLink5Description: https://datasheet.ciiva.com/16469/ncp1083-d-16469798.pdf?src-supplier=Future+Electronics; ComponentLink6URL: https://datasheet.ciiva.com/1512/1441870-1512909.pdf?src-supplier=Element14; ComponentLink6Description: https://datasheet.ciiva.com/1512/1441870-1512909.pdf?src-supplier=Element14; Manufacturer Part Number 1: NCP1083DER2G
IC55 = IRF9358TRPBF_DUAL_NMOS: Part Description: Mosfet Array 2 P-Channel (Dual) 30V 9.2A 2W Surface Mount 8-SO; Manufacturer: International Rectifier; Element Configuration: Dual; Drain to Source Breakdown Voltage: -30V; Rise Time: 7.2ns; Rds On Max: 16.3mR; Input Capacitance: 1.74nF; Nominal Vgs: -1.8V; Gate to Source Voltage (Vgs): 20V; Power Dissipation: 2W; Drain to Source Voltage (Vdss): 30V; Continuous Drain Current (ID): 9.2A; Turn-On Delay Time: 5.7ns; Turn-Off Delay Time: 146ns; Fall Time: 69ns; Drain to Source Resistance: 23.8mR; Supplier 1: Digi-Key; Supplier Part Number 1: IRF9358TRPBFDKR-ND; Manufacturer Part Number 1: IRF9358TRPBF; Stock 1: 0; RoHS: Yes; Mount: Surface Mount; Case/Package: SOIC; Number of Pins: 8; Min Operating Temperature: -55°C; Max Operating Temperature: 150°C; Package Quantity: 1; Packaging: Tape and Reel; Max Power Dissipation: 2W; Length: 5mm; Width: 4mm; Height: 1.5mm; Radiation Hardening: No; REACH SVHC: No SVHC; ComponentLink1URL: https://datasheet.ciiva.com/7798/irf9358pbf-7798959.pdf?src-supplier=Element14; ComponentLink1Description: https://datasheet.ciiva.com/7798/irf9358pbf-7798959.pdf?src-supplier=Element14; ComponentLink2URL: https://datasheet.ciiva.com/929/irf9358pbf-929243.pdf?src-supplier=Digi-Key; ComponentLink2Description: https://datasheet.ciiva.com/929/irf9358pbf-929243.pdf?src-supplier=Digi-Key; ComponentLink3URL: https://datasheet.ciiva.com/929/irf9358pbf-929244.pdf?src-supplier=Digi-Key; ComponentLink3Description: https://datasheet.ciiva.com/929/irf9358pbf-929244.pdf?src-supplier=Digi-Key; ComponentLink4URL: https://datasheet.ciiva.com/929/irf9358pbf-929245.pdf?src-supplier=Digi-Key; ComponentLink4Description: https://datasheet.ciiva.com/929/irf9358pbf-929245.pdf?src-supplier=Digi-Key
IC56 = USB_POWER_DISTR_CYPD3177-24LQXQT: Part Description: 428-CYPD3177-24LQXQTCT-ND; Manufacturer: Cypress; Supplier 1: Digi-Key; Supplier Part Number 1: 428-CYPD3177-24LQXQTCT-ND; Manufacturer Part Number 1: CYPD3177-24LQXQT; Stock 1: 19489; Pricing 1: 1=2,31000, 10=2,07900, 25=1,96080, 100=1,67080, 250=1,56880, 500=1,37270, 1000=1,13738 (USD); RoHS: No
J53 = Jumper: Manufacturer Part Number 1: 961102-6404-AR; Part Description: 2 Positions Header, Unshrouded Connector 0.100" (2.54mm) Through Hole Gold; Manufacturer: 3M; Connector Type: Header, Unshrouded; Supplier 1: Digi-Key; Supplier Part Number 1: 3M9447-ND; Contact Type: Male Pin; Color: Black; Mounting Type: Through Hole; Category: Connectors, Interconnects; Contact Finish: Gold
JMP8 = JUMP_2P_CONN_HEADER: Shorting Jumper, 2-position, 1.27mm pitch; Part Description: 2 (1 x 2) Position Shunt Connector Black Closed Top 0.100" (2.54mm) Gold; Manufacturer: Sullins; Manufacturer Part Number 1: SPC02SYAN; Number of Positions: 2; Pitch: 0.1inch; Supplier 1: Digi-Key; Supplier Part Number 1: S9001-ND; Stock 1: 570741; Pricing 1: 1=0.1, 10=0.059, 25=0.044, 50=0.0378, 100=0.0365, 250=0.03152, 500=0.03024, 1000=0.02646, 2500=0.02394 (USD); Colour: Black; Contact Plating: Gold; Package Quantity: 1000; Packaging: Bulk; Height: 0.256inch; Lead Free: Lead Free; ComponentLink1URL: http://www.sullinscorp.com/images/SPC02SYAN-0-3293.pdf; ComponentLink1Description: http://www.sullinscorp.com/images/SPC02SYAN-0-3293.pdf; ComponentLink2URL: https://drawings-pdf.s3.amazonaws.com/11134.pdf; ComponentLink2Description: https://drawings-pdf.s3.amazonaws.com/11134.pdf
L8 = Inductor_0603: Manufacturer: Taiyo Yuden; Manufacturer Part Number 1: NRS4018T1R0NDGJ; Part Description: 1 µH Shielded Drum Core, Wirewound Inductor 3.2 A 32.4mOhm Max Nonstandard; Core Material: Ferrite; Self Resonant Frequency: 90MHz; Tolerance: 30%; Saturation Current: 4A; Shielding: Shielded; DC Resistance (DCR): 32.4mR; Test Frequency: 100kHz; ComponentLink1URL: https://www.yuden.co.jp/productdata/catalog/en/wound04_e.pdf; ComponentLink1Description: https://www.yuden.co.jp/productdata/catalog/en/wound04_e.pdf; ComponentLink2URL: http://uk.rs-online.com/webdocs/10b3/0900766b810b3cd2.pdf; ComponentLink2Description: http://uk.rs-online.com/webdocs/10b3/0900766b810b3cd2.pdf; Supplier 1: Digi-Key; Supplier Part Number 1: 587-2888-1-ND; Stock 1: 277625; Pricing 1: 1=0,27000, 10=0,23800, 25=0,20840, 50=0,17860, 100=0,16370, 250=0,14884, 500=0,13990, 1000=0,10716 (USD); RoHS: Yes; Mount: Surface Mount; Case/Package: Nonstandard; Number of Pins: 2; Min Operating Temperature: -25°C; Max Operating Temperature: 125°C; Packaging: Cut Tape; Inductance: 1uH; Package Quantity: 3500; Current Rating: 3.2A; Inductance Tolerance: 30%; Resistor Type: Wirewound; Max DC Current: 4A; Termination: SMD/SMT; RMS Current (Irms): 3.2A; Series: NRS; Length: 4mm; Width: 0.157inch; Height: 1.8mm; Height - Seated (Max): 0.071inch; Depth: 4.2mm; Lead Pitch: 2.8mm; Radiation Hardening: No; Lead Free: Lead Free; Halogen Free: Halogen Free; REACH SVHC: Unknown; RoHS Compliant: Yes; ComponentLink3URL: https://datasheet.ciiva.com/1043/nrs4018t1r0ndgj-ss-1043587.pdf?src-supplier=Digi-Key; ComponentLink3Description: https://datasheet.ciiva.com/1043/nrs4018t1r0ndgj-ss-1043587.pdf?src-supplier=Digi-Key; ComponentLink4URL: https://datasheet.ciiva.com/25607/0900766b810b3cd2-25607942.pdf?src-supplier=RSComponents; ComponentLink4Description: https://datasheet.ciiva.com/25607/0900766b810b3cd2-25607942.pdf?src-supplier=RSComponents; ComponentLink5URL: https://datasheet.ciiva.com/8504/nrs4018t1r0ndgj-ss-8504305.pdf?src-supplier=Avnet; ComponentLink5Description: https://datasheet.ciiva.com/8504/nrs4018t1r0ndgj-ss-8504305.pdf?src-supplier=Avnet; Value: 1uH, 3.2A
LED8 = LED_green: Part Description: Green 572nm LED Indication - Discrete 2.2V 0603 (1608 Metric); Manufacturer Part Number 1: HSMG-C190; Manufacturer: Avago Technologies US Inc.; Current - Test: 20mA; Voltage - Forward (Vf) (Typ): 2.2V; Color: Green; Supplier 1: Digi-Key; Supplier Part Number 1: 516-1425-2-ND; Category: Optoelectronics; Package / Case: 0603 (1608 Metric)
LED9 = LED_green: Part Description: Green 572nm LED Indication - Discrete 2.2V 0603 (1608 Metric); Manufacturer Part Number 1: HSMG-C190; Manufacturer: Avago Technologies US Inc.; Current - Test: 20mA; Voltage - Forward (Vf) (Typ): 2.2V; Supplier 1: Digi-Key; Supplier Part Number 1: 516-1425-2-ND; Category: Optoelectronics; Color: Green; Package / Case: 0603 (1608 Metric)